# EAGLE design input.device  2 (EAGLE 7.2.0)
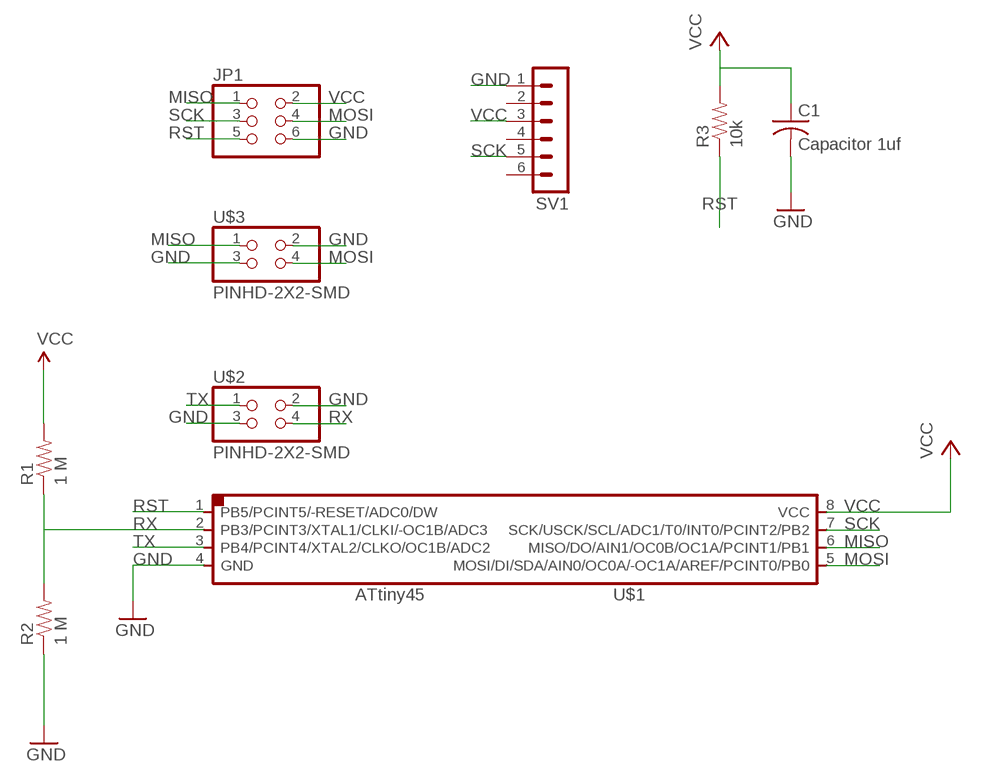
[diagram p0: schematic, sheet 1]

## Parts
C1  Capacitor 1uf  C-USC1206  [C1206]
JP1  PINHD-2X3-SMD  [2X03SMD]
R1  1 M  RESISTOR1206  [1206]
R2  1 M  RESISTOR1206  [1206]
R3  10k  RESISTOR1206  [1206]
SV1  MA06-1  [MA06-1]
U$1  ATTINY45SI  [SOIC8]
U$2  PINHD-2X2-SMD  [2X02SMD]
U$3  PINHD-2X2-SMD  [2X02SMD]

## Nets
GND: C1.2 JP1.6 R2.1 SV1.1 U$1.4(GND) U$2.2 U$2.3 U$3.2 U$3.3
MISO: JP1.1 U$1.6(MISO/DO/AIN1/OC0B/OC1A/PCINT1/PB1) U$3.1
MOSI: JP1.4 U$1.5(MOSI/DI/SDA/AIN0/OC0A/-OC1A/AREF/PCINT0/PB0) U$3.4
RST: JP1.5 R3.1 U$1.1(PB5/PCINT5/-RESET/ADC0/DW)
RX: R1.1 R2.2 U$1.2(PB3/PCINT3/XTAL1/CLKI/-OC1B/ADC3) U$2.4
SCK: JP1.3 SV1.5 U$1.7(SCK/USCK/SCL/ADC1/T0/INT0/PCINT2/PB2)
TX: U$1.3(PB4/PCINT4/XTAL2/CLKO/OC1B/ADC2) U$2.1
VCC: C1.1 JP1.2 R1.2 R3.2 SV1.3 U$1.8(VCC)
Unconnected: SV1.2 SV1.4 SV1.6

## Library data of the parts
C1 = 01_adafruit:C-US: CAPACITOR, American symbol
JP1 = 01_fab:PINHD-2X3-SMD: PIN HEADER
R1-R3 = 01_SparkFun:RESISTOR: Resistor Basic schematic elements and footprints for 0603, 1206, and PTH 1/10th watt (small) resistors.
SV1 = con-lstb:MA06-1: PIN HEADER; OC_FARNELL: unknown; OC_NEWARK: unknown
U$1 = 01_fab:ATTINY45
U$2 U$3 = 01_fab:PINHD-2X2-SMD

## Board
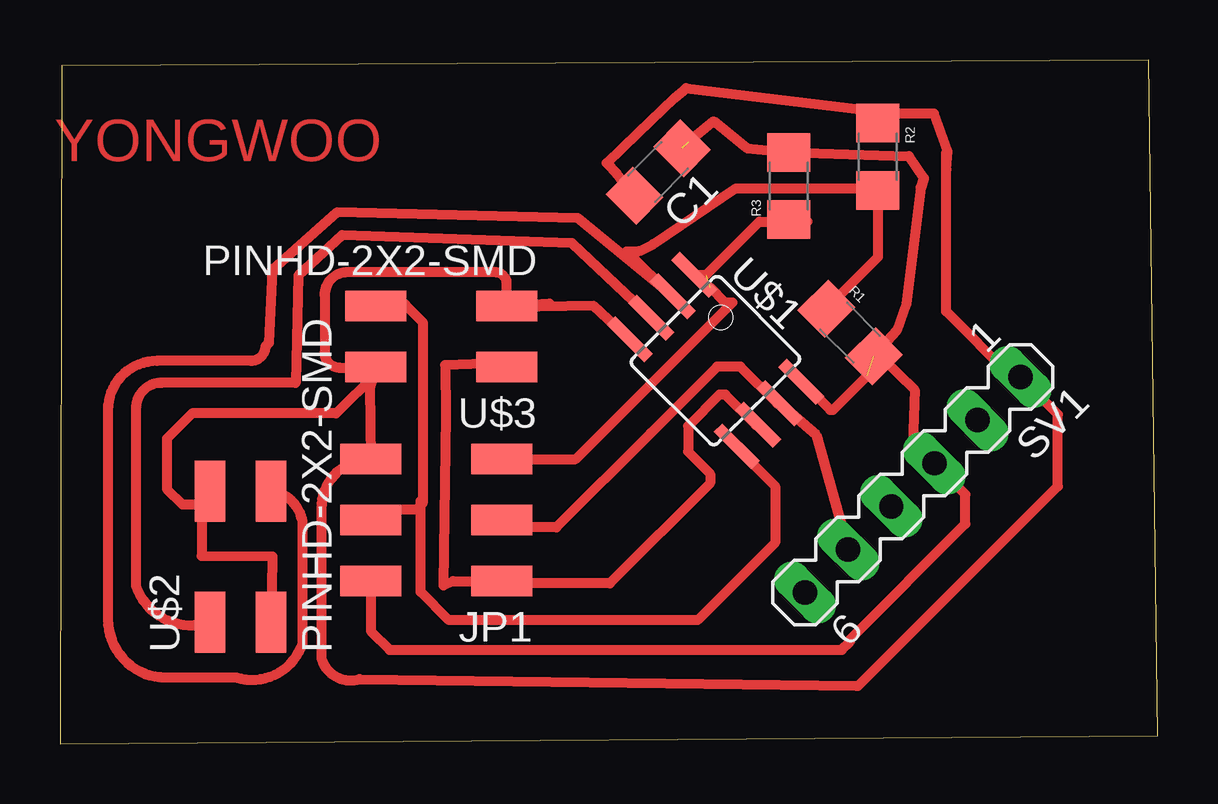
[diagram p1: board, top side]

Size 45.75 x 28.5 mm. Coordinates in mm from the lower left corner, seen from the top.
Outline: 0,0 45.75,0.35 45.37,28.5 0.08,28.25 0,0
Copper layers (1*16): Top 0.035mm / dielectric 1.5mm / Bottom 0.035mm
Design rules "default": minimum track width 10mil, minimum drill 24mil, track to track 8mil, track to pad 8mil, pad to pad 8mil, via to via 8mil, smd to smd 8mil, copper to edge 40mil, drill to drill 8mil, minimum pad ring 10mil, minimum via ring 8mil, stop-mask expansion 4mil, vias tented up to drill 0mil, thermal gap 10mil

### Footprints (pad centres in the part's own frame; a part is rotated, then mirrored left to right if it is on the bottom)
C1206 = smd 1.6 x 1.8: 1 -1.4,0; 2 1.4,0
2X03SMD = smd 2.54 x 1.27: 1 -2.54,2.54; 2 2.92,2.54; 3 -2.54,0; 4 2.92,0; 5 -2.54,-2.54; 6 2.92,-2.54
1206 = smd 1.6 x 1.8: 1 -1.4,0; 2 1.4,0
MA06-1 = drill 1.016 long: 1 -6.35,0; 2 -3.81,0; 3 -1.27,0; 4 1.27,0; 5 3.81,0; 6 6.35,0
SOIC8 = smd 0.5 x 2.2: 1 -1.905,-3.154; 2 -0.645,-3.154; 3 0.625,-3.154; 4 1.895,-3.154; 5 1.905,3.154; 6 0.635,3.154; 7 -0.635,3.154; 8 -1.905,3.154
2X02SMD = smd 2.54 x 1.27: 1 -2.54,1.27; 2 2.92,1.27; 3 -2.54,-1.27; 4 2.92,-1.27

### Placement (x,y rotation side)
C1  24.92,23.83 225 top
JP1  15.88,9.33 180 top
R1  32.92,17.14 315 top
R2  34.08,24.47 270 top
R3  30.36,23.25 90 top
SV1  35.53,10.8 225 top
U$1  27.31,15.97 225 top
U$2  7.53,7.62 90 top
U$3  16.07,16.97 180 top

### Tracks (layer width: path | path; a pad name or v marks a point on that pad's centre or on a via)
GND
  Top 0.406: U$2.2 5.91,9.75 | 5.91,9.75 5.91,7.84 8.85,7.82 U$2.3 | U$1.4 22.23,18.25 18.86,18.2 20.4,18.34 U$3.3 18.61,19.18 arc90 18.14,19.65 11.97,19.65 arc90 11.03,18.71 11.03,16.3 arc90 11.65,15.68 13.13,15.68 arc90 U$3.2 | U$3.2 12.9,14.85 JP1.6 12.93,11.87 arc90 10.89,9.82 10.89,3.56 arc90 12.48,2.7 33.19,2.42 33.26,2.42 41.58,10.73 41.58,13.74 SV1.1 39.66,15.29 36.93,18.02 36.93,24.63 36.99,24.69 | C1.2 23.9,22.75 | 23.9,22.75 23.21,23.73 22.78,24.2 24.1,25.47 25.62,26.92 26.09,27.33 33.51,26.43 R2.1 34.48,26.26 36.42,26.26 36.99,24.69 | U$3.2 13.15,15.41 11.51,13.77 5.5,13.77 4.46,12.72 4.46,10.62 5.1,9.98 5.68,9.98 5.91,9.75 | 36.93,23.94 36.99,24.69 | 23.9,22.75 23.9,22.68 23.84,22.62 23.84,23.37 23.89,23.42 23.89,23.38
MISO
  Top 0.406: JP1.1 18.36,6.76 | U$3.1 17.69,15.83 16.05,15.78 16.08,13.72 15.98,6.6 16.37,6.79 JP1.1 | U$1.6 28.98,13.29 27.72,14.56 27.48,14.56 26.17,13.24 26.17,12.18 27.09,11.25 27.09,10.86 22.91,6.69 18.52,6.69 JP1.1
MOSI
  Top 0.406: JP1.4 13.07,9.44 13.07,9.76 | JP1.4 13.02,9.33 13.02,9.58 arc90 12.95,9.65 12.95,9.4 | 13.02,9.4 13.27,9.15 13.27,9.02 13.02,9.27 13.02,9.34 JP1.4 arc90 JP1.4 | U$3.4 13.15,18.26 13.19,18.3 14.39,18.3 15.11,17.57 15.11,10.21 | 15.11,10.21 15.11,10.02 14.86,9.77 13.4,9.77 JP1.4 | U$1.5 28.19,12.34 29.79,10.74 29.79,8.38 26.57,5.16 16.2,5.16 15.02,6.34 15.02,10.13 15.11,10.21
RST  (1 unrouted)
  Top 0.406: U$1.1 26.93,19.55 29.14,21.76 31.14,21.76 R3.1 | JP1.5 21.49,11.87 28.01,18.39 27.72,18.39 27.09,19.02
RX
  Top 0.406: U$2.4 arc-90 10.11,8.83 10.11,4.21 arc-90 7.35,2.77 4.41,2.77 arc-90 2,5.18 2,13.92 arc-90 4.03,15.96 7.95,15.96 arc90 8.55,16.56 8.71,16.71 8.84,19.75 11.54,22.15 21.57,21.9 U$1.2 23.59,20.53 24.13,20.53 24.71,20.82 28.16,23.15 34.09,23.15 R2.2 34.08,20.28 R1.1
SCK
  Top 0.406: SV1.5 31.51,12.88 U$1.7 29.88,14.19 28.35,15.72 27.38,15.72 24.61,12.95 | 24.61,12.95 | 24.61,12.95 20.68,9.02 19.27,9.02 18.96,9.33 JP1.3
TX
  Top 0.406: U$1.3 21.34,20.87 11.75,21.2 9.94,19.52 9.82,15.05 4.23,15.05 arc90 3.16,13.98 3.16,6.58 arc90 U$2.1
VCC  (2 unrouted)
  Top 0.406: 26.18,25.08 27.23,25.94 28.62,24.83 R3.2 35.37,24.49 36,23.58 35.86,23.18 35.26,18.34 34.86,17.23 R1.2 34.17,16.15 35.61,14.76 35.53,12.46 SV1.3 37.73,10.4 37.73,9.16 32.92,4.35 32.92,4.26 32.58,3.92 13.73,3.92 12.96,4.7 JP1.2 | U$1.8 30.92,15.09 32.09,13.92 32.21,13.92 33.63,15.34

### Text on the board
Top: YONGWOO